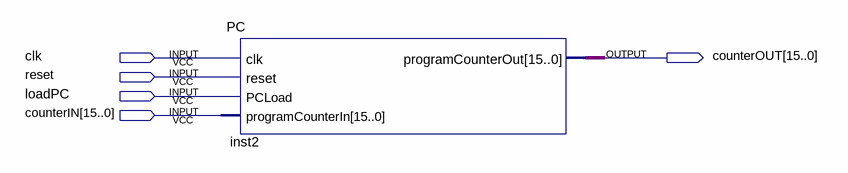
[diagram p0: schematic sheet]
// Quartus schematic PC_testbench.bdf as structural Verilog: 1 symbols, 5 pins
module PC_testbench (
  input  clk,
  input  reset,
  input  loadPC,
  input  [15:0] counterIN,
  output [15:0] counterOUT
);

  PC inst2 (.clk(clk), .reset(reset), .PCLoad(loadPC), .programCounterIn(counterIN), .programCounterOut(counterOUT));
endmodule
